# Altium schematic sheet SSR.SchDoc
size A4
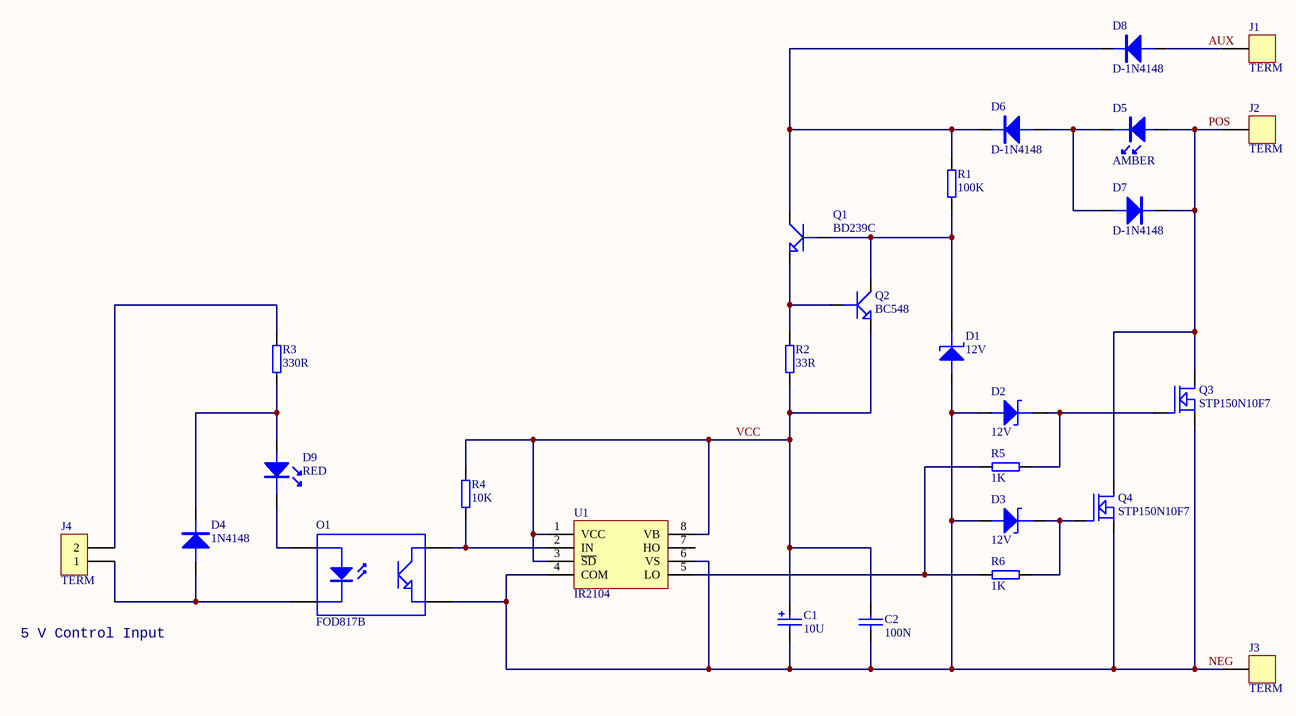
[diagram p0: SSR.SchDoc]

## Parts
C1  10U  [RADIAL02P]
C2  100N  [AXIAL02]
D1  12V  [DO35S]
D2  12V  [DO35S]
D3  12V  [DO35S]
D4  1N4148  [DO35S]
D5  AMBER  [LED5MM]
D6  D-1N4148  [DO35S]
D7  D-1N4148  [DO35S]
D8  D-1N4148  [DO35S]
D9  RED  [LED5MM]
J1  TERM  [SCREW3]
J2  TERM  [SCREW6]
J3  TERM  [SCREW6]
J4  TERM  [MKD500S2]
O1  FOD817B  [DIP4]
Q1  BD239C  [TO220]
Q2  BC548  [TO92]
Q3  STP150N10F7  [TO220FS]
Q4  STP150N10F7  [TO220FS]
R1  100K  [AXIAL04]
R2  33R  [AXIAL04]
R3  330R  [AXIAL04]
R4  10K  [AXIAL04]
R5  1K  [AXIAL04]
R6  1K  [AXIAL04]
U1  IR2104  [DIP8]

## Nets
AUX: D8.1(A) J1.1
NEG: C1.2 C2.2 D1.1(A) D2.1(A) D3.1(A) J3.1 O1.3(E) Q3.3(S) Q4.3(S) U1.4(COM) U1.6(VS)
POS: D5.1(A) D7.2(K) J2.1 Q3.2(D) Q4.2(D)
VCC: C1.1 C2.1 Q2.1(E) R2.1 R4.2 U1.1(VCC) U1.3(~{SD}) U1.8(VB)
NetD1_2: D1.2(K) Q1.2(B) Q2.3(C) R1.1
NetD2_2: D2.2(K) Q3.1(G) R5.2
NetD3_2: D3.2(K) Q4.1(G) R6.2
NetD4_1: D4.1(A) J4.1 O1.2(K)
NetD4_2: D4.2(K) D9.1(A) R3.1
NetD5_2: D5.2(K) D6.1(A) D7.1(A)
NetD6_2: D6.2(K) D8.2(K) Q1.3(C) R1.2
NetD9_2: D9.2(K) O1.1(A)
NetJ4_2: J4.2 R3.2
NetO1_4: O1.4(C) R4.1 U1.2(IN)
NetQ1_1: Q1.1(E) Q2.2(B) R2.2
NetR5_1: R5.1 R6.1 U1.5(LO)

Not connected (* = marked no-connect by the designer): U1 7(HO)

## Notes on the sheet
- 5 V Control Input

## Library data of the parts
C1 = C-A10U: CAP
C2 = C-B100N: CAPACITOR
D1-D3 = D-BZX79-12: ZENER DIODE
D5 = O-AMBER: LED
D6-D8 = D-1N4148: 1N4148
D9 = O-RED: LED
J1 = J-SCREW3: CONNECTOR
J2 J3 = J-SCREW6: CONNECTOR
J4 = J-SCR-2: CONNECTOR
O1 = O-FOD817B: OPTO ISOLATOR
Q1 = Q-BD239C
Q2 = Q-BC548
Q3 Q4 = Q-STP150N10F7: MOSFET
R1 = R-A100K: RESISTOR; Detail: *; Order: *; Cost: *
R2 = R-A33R: RESISTOR; Detail: *; Order: *; Cost: *
R3 = R-A330R: RESISTOR; Detail: *; Order: *; Cost: *
R4 = R-A10K: RESISTOR; Detail: *; Order: *; Cost: *
R5 R6 = R-A1K: RESISTOR; Detail: *; Order: *; Cost: *
U1 = U-IR2104: GATE DRIVER